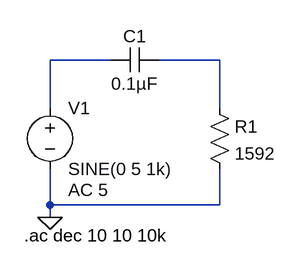
[diagram p0: schematic PL1.asc]
PL1.asc, the LTspice schematic file:
Version 4
SHEET 1 880 680
WIRE 288 80 208 80
WIRE 432 80 352 80
WIRE 208 144 208 80
WIRE 432 144 432 80
WIRE 208 272 208 224
WIRE 432 272 432 224
WIRE 432 272 208 272
WIRE 208 288 208 272
FLAG 208 288 0
SYMBOL voltage 208 128 R0
WINDOW 123 24 124 Left 2
WINDOW 39 0 0 Left 2
SYMATTR InstName V1
SYMATTR Value SINE(0 5 1k)
SYMATTR Value2 AC 5
SYMBOL cap 352 64 R90
WINDOW 0 0 32 VBottom 2
WINDOW 3 32 32 VTop 2
SYMATTR InstName C1
SYMATTR Value 0.1µF
SYMBOL res 416 128 R0
SYMATTR InstName R1
SYMATTR Value 1592
TEXT 174 312 Left 2 !.ac dec 10 10 10k

The netlist it stands for:
* PL1.asc
V1 N001 0 SINE(0 5 1k) AC 5
C1 N002 N001 0.1µF
R1 N002 0 1592
.ac dec 10 10 10k
.backanno
.end